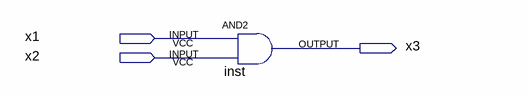
[diagram p0: schematic sheet]
// Quartus schematic GateDemo.bdf as structural Verilog: 1 symbols, 3 pins
module GateDemo (
  input  x1,
  input  x2,
  output x3
);

  and inst (x3, x1, x2);
endmodule
